# EAGLE design tester rp2040 (EAGLE 9.6.2)
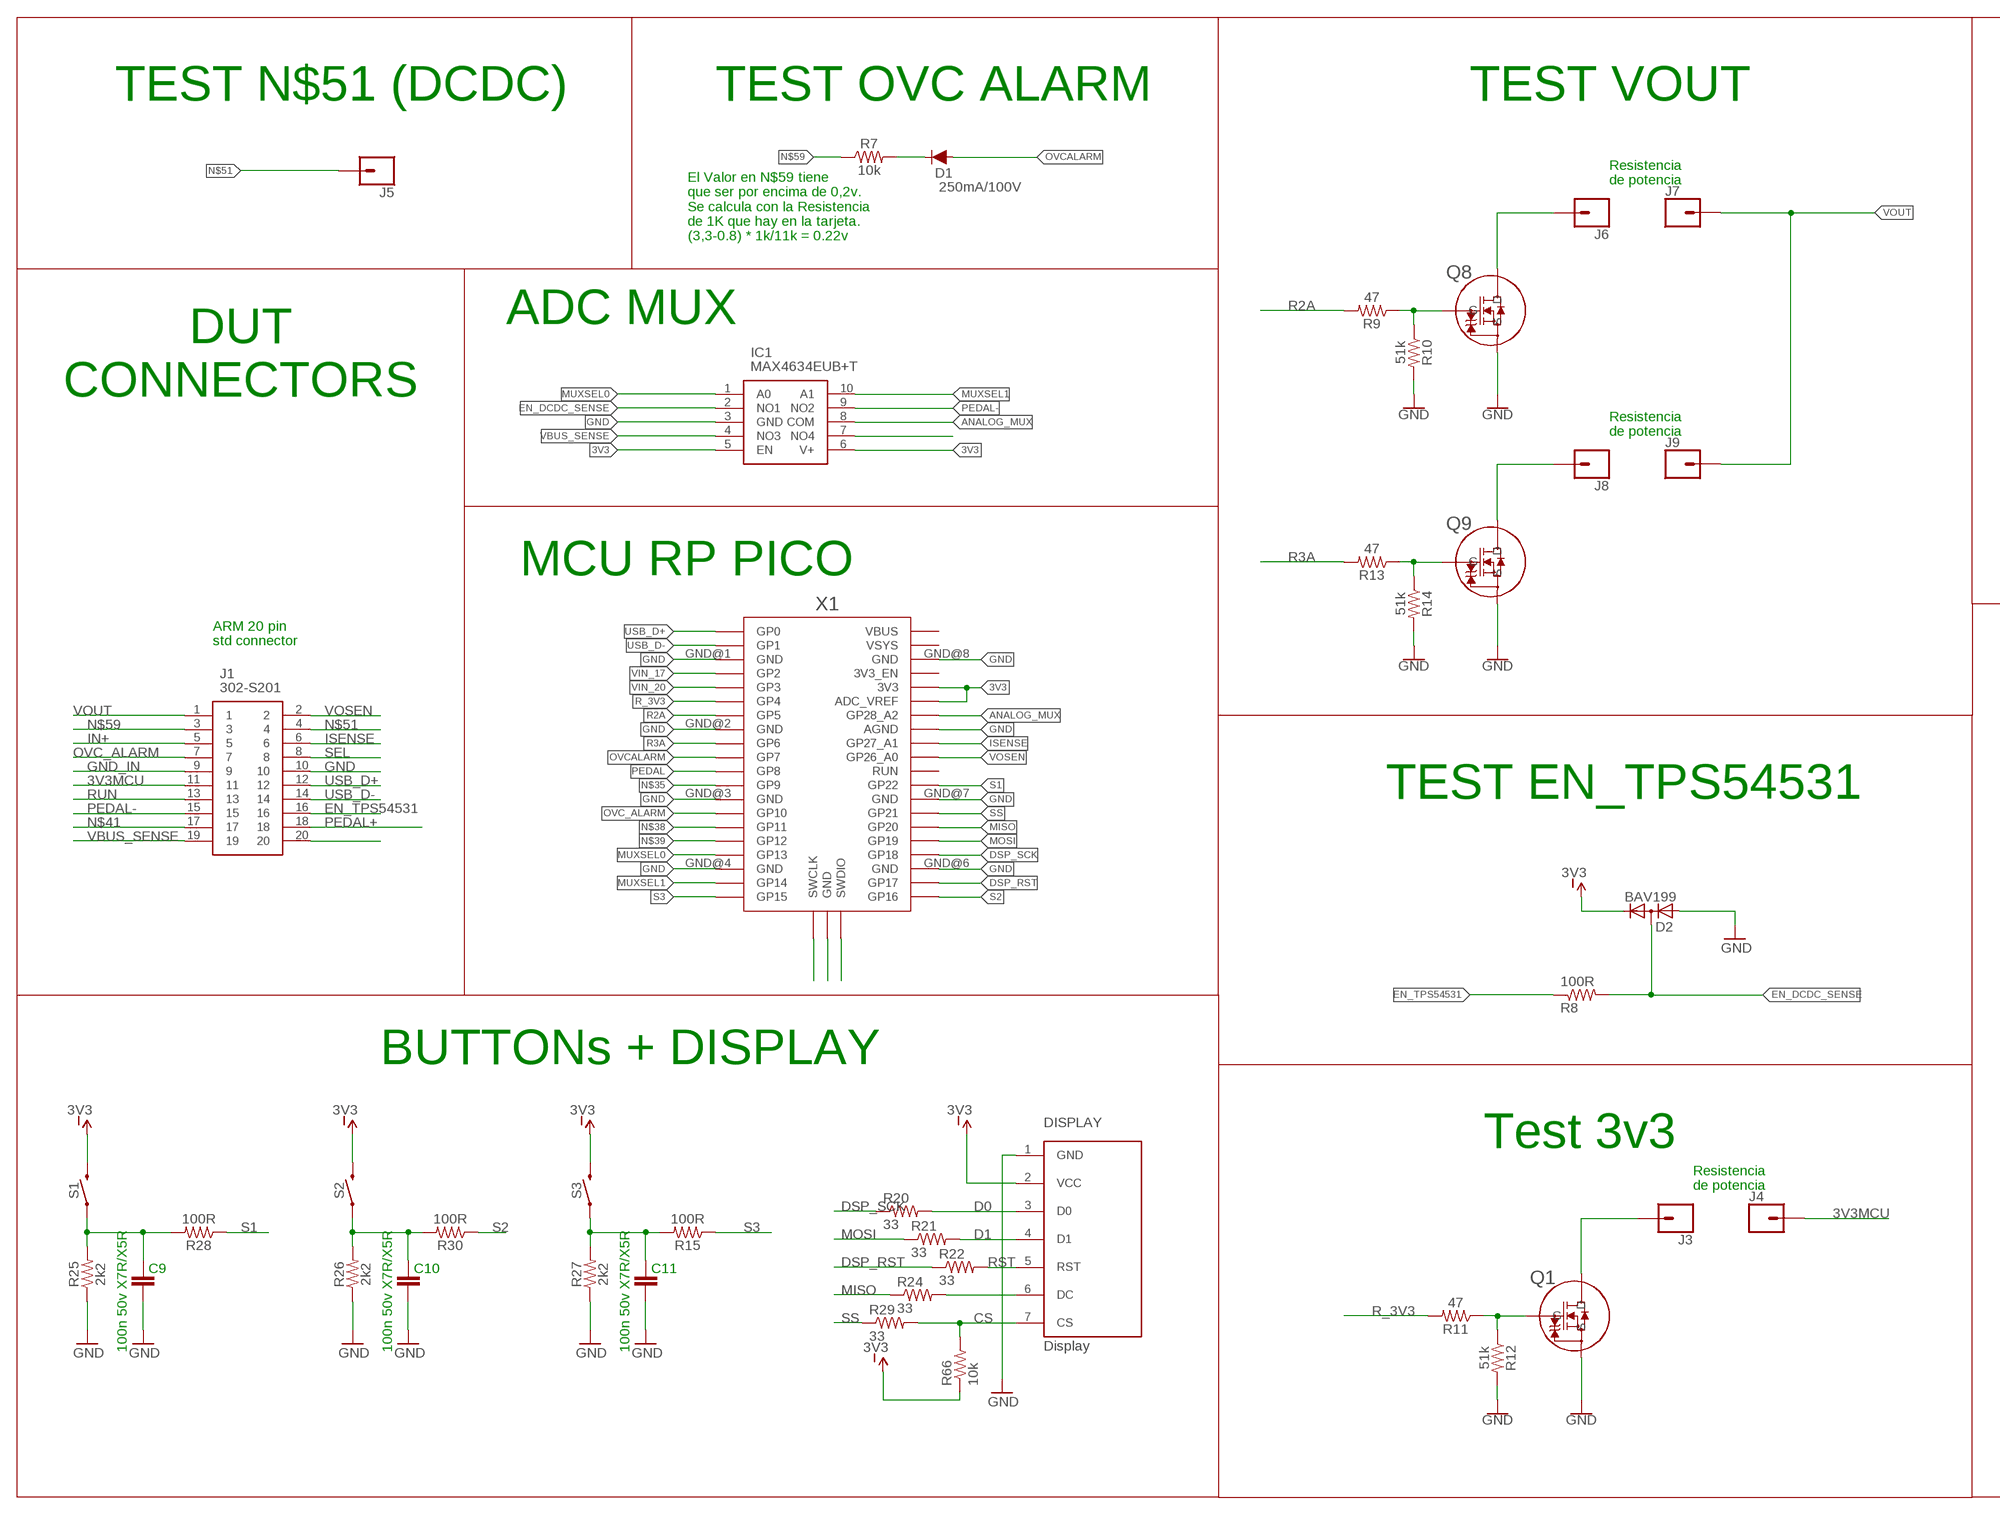
[diagram p0: schematic, sheet 1, part 1 of 2]
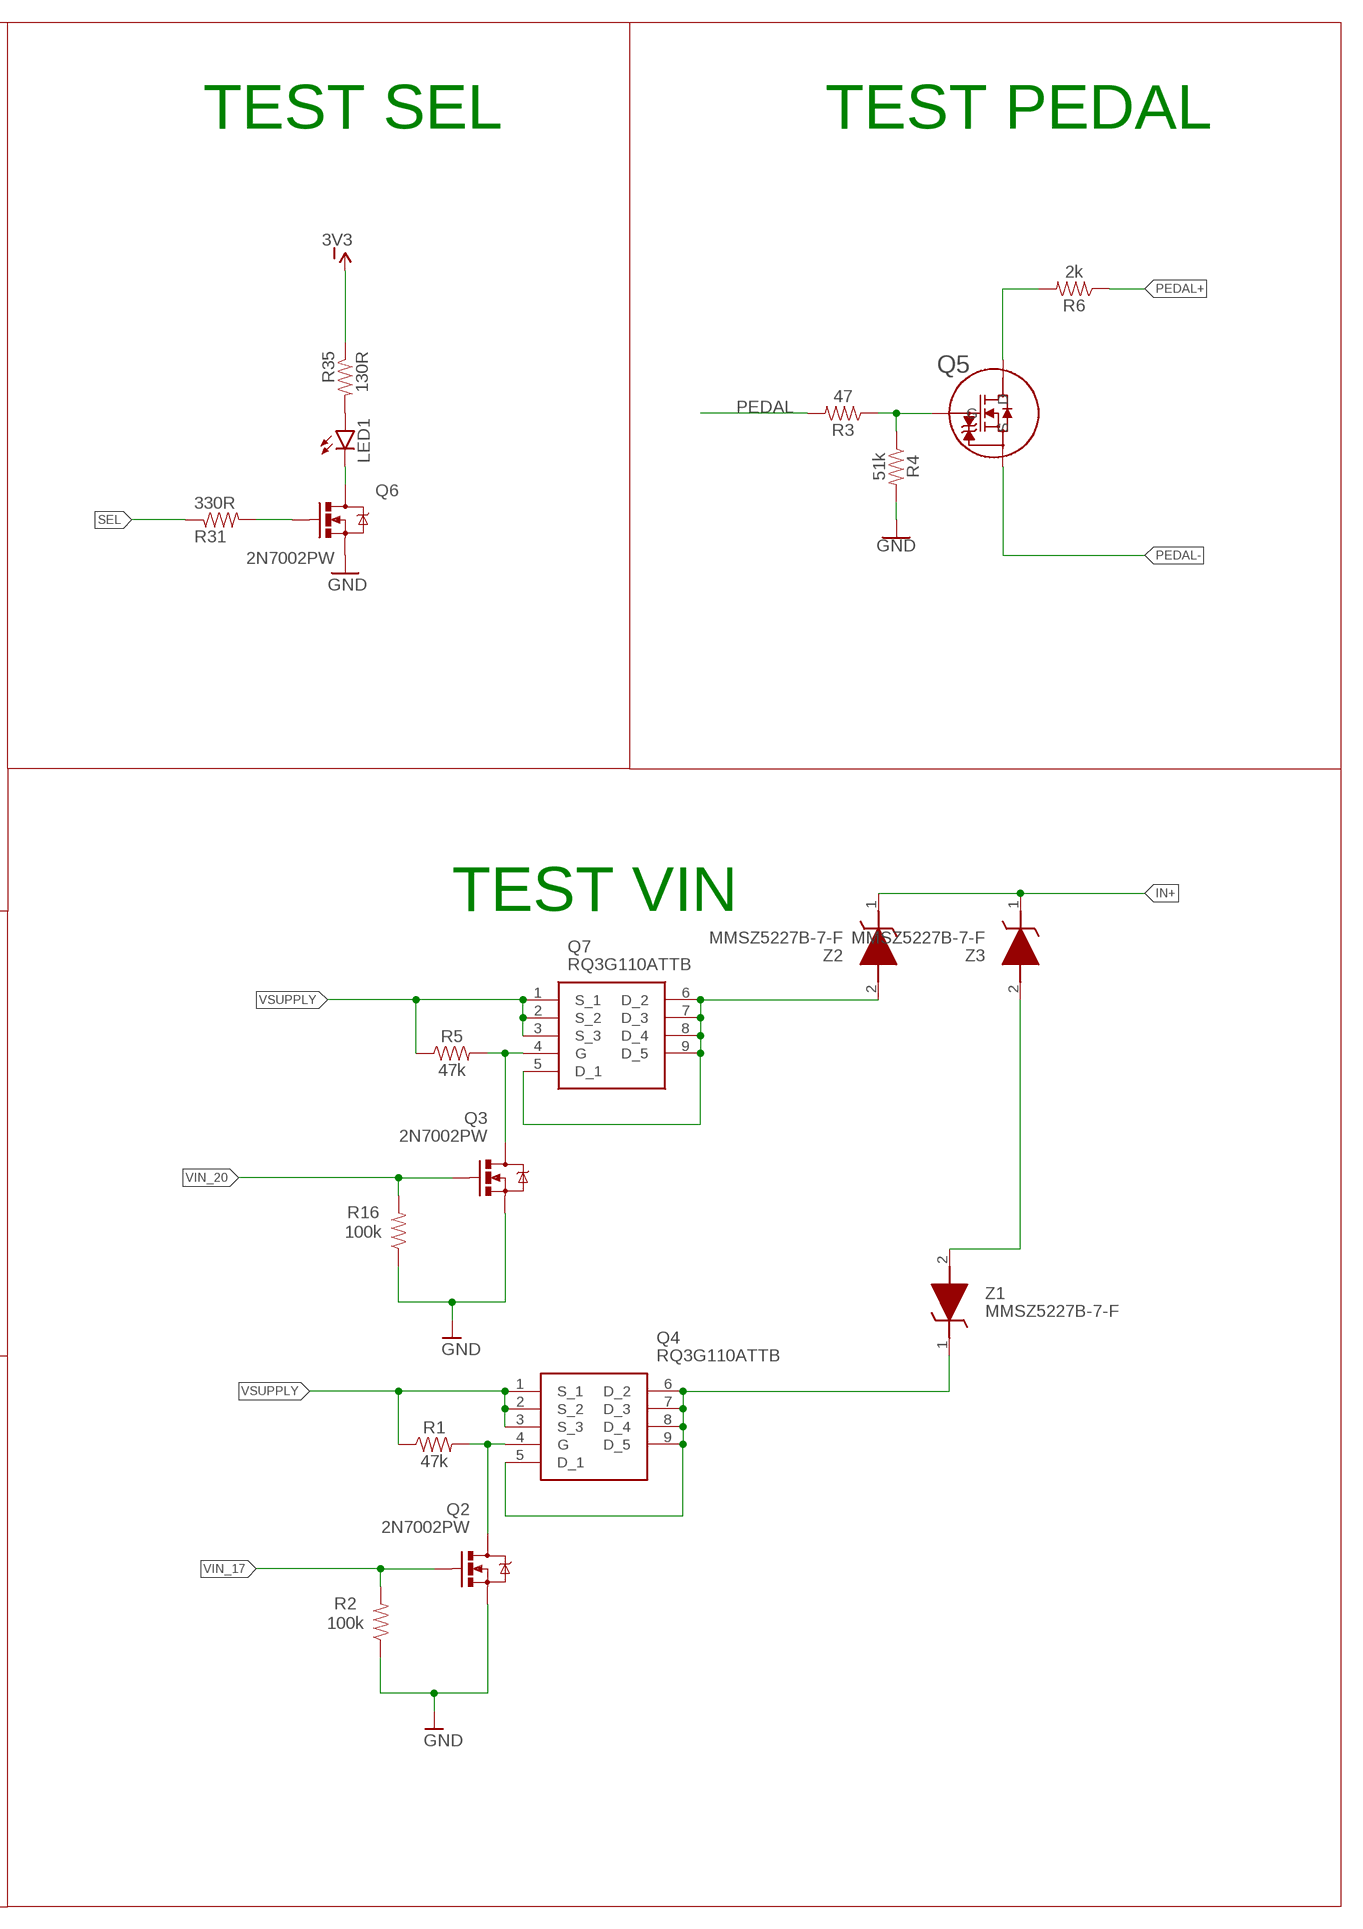
[diagram p1: schematic, sheet 1, part 2 of 2]

## Parts
C9  100n 50v X7R/X5R  CAP0805  [0805]
C10  100n 50v X7R/X5R  CAP0805  [0805]
C11  100n 50v X7R/X5R  CAP0805  [0805]
D1  250mA/100V  DIODE-BAS16J  [SOD-323]
D2  BAV199  [SOT23]
DISPLAY  Display  OLED_LCD  [OLED_LCD]
IC1  MAX4634EUB+T  [SOP50P490X110-10N]
J1  302-S201  [SHDR20W66P254_2X10_3300X905X90]
J3  CONN_01  [1X01]
J4  CONN_01  [1X01]
J5  CONN_01  [1X01]
J6  CONN_01  [1X01]
J7  CONN_01  [1X01]
J8  CONN_01  [1X01]
J9  CONN_01  [1X01]
LED1  LED3MM  [LED3MM]
Q1  PJA3416AE_R1_00001  [SOT23_PJA3416_PNJ]
Q2  2N7002PW  MOSFET-NCHANNEL2N7002PW  [SOT323]
Q3  2N7002PW  MOSFET-NCHANNEL2N7002PW  [SOT323]
Q4  RQ3G110ATTB  [RQ3G110ATTB]
Q5  PJA3416AE_R1_00001  [SOT23_PJA3416_PNJ]
Q6  2N7002PW  MOSFET-NCHANNEL2N7002PW  [SOT323]
Q7  RQ3G110ATTB  [RQ3G110ATTB]
Q8  PJA3416AE_R1_00001  [SOT23_PJA3416_PNJ]
Q9  PJA3416AE_R1_00001  [SOT23_PJA3416_PNJ]
R1  47k  RESISTOR0402  [0402]
R2  100k  RESISTOR0402  [0402]
R3  47  RESISTOR0805  [0805]
R4  51k  RESISTOR0805  [0805]
R5  47k  RESISTOR0402  [0402]
R6  2k  RESISTOR0805  [0805]
R7  10k  RESISTOR0805  [0805]
R8  100R  RESISTOR0805  [0805]
R9  47  RESISTOR0805  [0805]
R10  51k  RESISTOR0805  [0805]
R11  47  RESISTOR0805  [0805]
R12  51k  RESISTOR0805  [0805]
R13  47  RESISTOR0805  [0805]
R14  51k  RESISTOR0805  [0805]
R15  100R  RESISTOR0805  [0805]
R16  100k  RESISTOR0402  [0402]
R20  33  RESISTOR0805  [0805]
R21  33  RESISTOR0805  [0805]
R22  33  RESISTOR0805  [0805]
R24  33  RESISTOR0805  [0805]
R25  2k2  RESISTOR0805  [0805]
R26  2k2  RESISTOR0805  [0805]
R27  2k2  RESISTOR0805  [0805]
R28  100R  RESISTOR0805  [0805]
R29  33  RESISTOR0805  [0805]
R30  100R  RESISTOR0805  [0805]
R31  330R  RESISTOR0805  [0805]
R35  130R  RESISTOR0805  [0805]
R66  10k  RESISTOR0805  [0805]
S1  MOMENTARY-SWITCH-SPST-SMD-5.2MM  [TACTILE_SWITCH_SMD_5.2MM]
S2  MOMENTARY-SWITCH-SPST-SMD-5.2MM  [TACTILE_SWITCH_SMD_5.2MM]
S3  MOMENTARY-SWITCH-SPST-SMD-5.2MM  [TACTILE_SWITCH_SMD_5.2MM]
X1  RPI_PICO_IG-TH  [RPI_PICO_TH]
Z1  MMSZ5227B-7-F  [SOD3716X135N]
Z2  MMSZ5227B-7-F  [SOD3716X135N]
Z3  MMSZ5227B-7-F  [SOD3716X135N]

## Nets
3V3: D2.2(C) DISPLAY.2(VCC) IC1.5(EN) IC1.6(V+) R35.1 R66.1 S1.3 S2.3 S3.3 X1.3V3 X1.ADC_VREF
3V3MCU: J1.11 J4.1
ANALOG_MUX: IC1.8(COM) X1.GP28_A2
CS: DISPLAY.7(CS) R29.2 R66.2
D0: DISPLAY.3(D0) R20.2
D1: DISPLAY.4(D1) R21.2
DSP_RST: R22.1 X1.GP17
DSP_SCK: R20.1 X1.GP18
EN_DCDC_SENSE: D2.3(AC) IC1.2(NO1) R8.2
EN_TPS54531: J1.16 R8.1
GND: C9.1 C10.1 C11.1 D2.1(A) DISPLAY.1(GND) IC1.3(GND) J1.10 Q1.2(S) Q2.2(S) Q3.2(S) Q6.2(S) Q8.2(S) Q9.2(S) R2.1 R4.2 R10.2 R12.2 R14.2 R16.1 R25.1 R26.1 R27.1 X1.AGND X1.GND@1(GND) X1.GND@2(GND) X1.GND@3(GND) X1.GND@4(GND) X1.GND@6(GND) X1.GND@7(GND) X1.GND@8(GND)
GND_IN: J1.9
IN+: J1.5 Q7.5(D_1) Q7.6(D_2) Q7.7(D_3) Q7.8(D_4) Q7.9(D_5) Z2.1(K) Z2.2(A) Z3.1(K)
ISENSE: J1.6 X1.GP27_A1
MISO: R24.1 X1.GP20
MOSI: R21.1 X1.GP19
MUXSEL0: IC1.1(A0) X1.GP13
MUXSEL1: IC1.10(A1) X1.GP14
N$1: J3.1 Q1.3(D)
N$2: Z1.2(A) Z3.2(A)
N$3: Q3.3(D) Q7.4(G) R5.2
N$4: D1.C R7.2
N$5: Q2.3(D) Q4.4(G) R1.2
N$7: DISPLAY.6(DC) R24.2
N$9: Q5.1(G) R3.1 R4.1
N$14: Q4.5(D_1) Q4.6(D_2) Q4.7(D_3) Q4.8(D_4) Q4.9(D_5) Z1.1(K)
N$19: Q1.1(G) R11.1 R12.1
N$20: J1.20
N$21: Q5.3(D) R6.2
N$24: Q6.1(G) R31.2
N$25: LED1.A R35.2
N$26: LED1.K(C) Q6.3(D)
N$31: Q8.1(G) R9.1 R10.1
N$35: X1.GP9
N$36: J6.1 Q8.3(D)
N$38: X1.GP11
N$39: X1.GP12
N$41: J1.17
N$42: Q9.1(G) R13.1 R14.1
N$45: X1.SWCLK
N$46: X1.GND@5(GND)
N$47: X1.SWDIO
N$48: J8.1 Q9.3(D)
N$49: C9.2 R25.2 R28.2 S1.1
N$50: C10.2 R26.2 R30.2 S2.1
N$51: J1.4 J5.1
N$52: C11.2 R15.2 R27.2 S3.1
N$58: IC1.7(NO4)
N$59: J1.3 R7.1
OVC_ALARM: J1.7 X1.GP10
OVCALARM: D1.A X1.GP7
PEDAL: R3.2 X1.GP8
PEDAL+: J1.18 R6.1
PEDAL-: IC1.9(NO2) J1.15 Q5.2(S)
R2A: R9.2 X1.GP5
R3A: R13.2 X1.GP6
R_3V3: R11.2 X1.GP4
RST: DISPLAY.5(RST) R22.2
RUN: J1.13
S1: R28.1 X1.GP22
S2: R30.1 X1.GP16
S3: R15.1 X1.GP15
SEL: J1.8 R31.1
SS: R29.1 X1.GP21
USB_D+: J1.12 X1.GP0
USB_D-: J1.14 X1.GP1
VBUS_SENSE: IC1.4(NO3) J1.19
VIN_17: Q2.1(G) R2.2 X1.GP2
VIN_20: Q3.1(G) R16.2 X1.GP3
VOSEN: J1.2 X1.GP26_A0
VOUT: J1.1 J7.1 J9.1
VSUPPLY: Q4.1(S_1) Q4.2(S_2) Q4.3(S_3) Q7.1(S_1) Q7.2(S_2) Q7.3(S_3) R1.1 R5.1
Unconnected: X1.3V3_EN X1.RUN X1.VBUS X1.VSYS

## Notes on the sheet
- TEST N$51 (DCDC) | TEST OVC ALARM | TEST VOUT | TEST SEL | TEST PEDAL
- Resistencia
  de potencia
- El Valor en N$59 tiene
  que ser por encima de 0,2v.
  Se calcula con la Resistencia 
  de 1K que hay en la tarjeta.
  (3,3-0.8) * 1k/11k = 0.22v
- ADC MUX
- DUT
  CONNECTORS
- Resistencia
  de potencia
- MCU RP PICO
- ARM 20 pin
  std connector
- TEST VIN
- TEST EN_TPS54531
- BUTTONs + DISPLAY
- Test 3v3
- Resistencia
  de potencia

## Library data of the parts
C9-C11 = SparkFun-Passives:CAP: Capacitor Standard 0603 ceramic capacitor, and 0.1" leaded capacitor.
D1 = SparkFun-DiscreteSemi:DIODE: Diode These are standard reverse protection diodes and small signal diodes. SparkFun Products: SparkFun SparkPunk Sound Kit <https://www.sparkfun.com/products/11177> SparkFun ESP8266 Thing <https://www.sparkfun.com/products/13231>; PROD_ID: DIO-09646
D2 = diode:BAV199: DIODE low-leakage double diode
DISPLAY = EDCPSU:OLED_LCD
IC1 = MAX4634EUB+T:MAX4634EUB+T: Multiplexer Switch ICs Fast, Low-Voltage, 4 Ohm, 4-Channel CMOS Analog Multiplexer Source: Datasheet <https://datasheets.maximintegrated.com/en/ds/MAX4634.pdf>; ARROW_PART_NUMBER: MAX4634EUB+T; ARROW_PRICE-STOCK: https://www.arrow.com/en/products/max4634eubt/maxim-integrated?region=nac; DESCRIPTION: Multiplexer Switch ICs Fast, Low-Voltage, 4 Ohm, 4-Channel CMOS Analog Multiplexer; HEIGHT: 1.1mm; MANUFACTURER_NAME: Analog Devices; MANUFACTURER_PART_NUMBER: MAX4634EUB+T; MOUSER_PART_NUMBER: 700-MAX4634EUBT; MOUSER_PRICE-STOCK: https://www.mouser.co.uk/ProductDetail/Maxim-Integrated/MAX4634EUB%2bT?qs=LHmEVA8xxfaJv5r8NBN1ug%3D%3D
J1 = 302-S201:302-S201: CONN HEADER VERT 20POS GOLD Source: Datasheet <http://www.on-shore.com/wp-content/uploads/2018/04/302-SXX1.pdf>; DESCRIPTION: CONN HEADER VERT 20POS GOLD; HEIGHT: 9.05mm; MANUFACTURER_NAME: On Shore Technology Inc.; MANUFACTURER_PART_NUMBER: 302-S201
J3-J9 = SparkFun-Connectors:CONN_01: Single connection point. Often used as Generic Header-pin footprint for 0.1 inch spaced/style header connections On any of the 0.1 inch spaced packages, you can populate with these: Break Away Headers - Straight <https://www.sparkfun.com/products/116> (PRT-00116) Break Away Male Headers - Right Angle <https://www.sparkfun.com/products/553> (PRT-00553) Female Headers <https://www.sparkfun.com/products/115> (PRT-00115) Break Away Headers - Machine Pin <https://www.sparkfun.com/products/117> (PRT-00117) Break Away Female Headers - Swiss Machine Pin <https://www.sparkfun.com/products/743> (PRT-00743) This device is also useful as a general connection point to wire up your design to another part of your project. Our various solder wires solder well into these plated through hole pads. Hook-Up Wire - Assortment (Stranded, 22 AWG) <https://www.sparkfun.com/products/11375> (PRT-11375) Hook-Up Wire - Assortment (Solid Core, 22 AWG) <https://www.sparkfun.com/products/11367> (PRT-11367) View the entire wire category on our website here <https://www.sparkfun.com/categories/141> Special notes: SMTSO-256-ET is a "flush mount" nut for a 4-40 screw. We mostly use this on specialty testbeds; it is a nice way to connect hardware to your PCB at an adjustable hieght. Also note, the SNAP packages are for using a snappable style connector. We sell a baggie of snaps and they are also used on two LilyPad designs: Snap Assortment - 30 pack (male and female) <https://www.sparkfun.com/products/11347> (DEV-11347) LilyPad Arduino SimpleSnap <https://www.sparkfun.com/products/10941> (DEV-10941) LilyPad SimpleSnap Protoboard <https://www.sparkfun.com/products/10940> (DEV-10940)
LED1 = SparkFun-LED:LED: LEDs Standard schematic elements and footprints for 5mm, 3mm, 1206, and 0603 sized LEDs. 5mm - Spark Fun Electronics SKU : COM-00529 (and others)
Q1 Q5 Q8 Q9 = PJA3416AE_R1_00001:PJA3416AE_R1_00001; COPYRIGHT: Copyright (C) 2022 Ultra Librarian. All rights reserved.; DIGI-KEY_PART_NUMBER_1: 3757-PJA3416AE_R1_00001TR-ND; DIGI-KEY_PART_NUMBER_2: 3757-PJA3416AE_R1_00001CT-ND; DIGI-KEY_PART_NUMBER_3: 3757-PJA3416AE_R1_00001DKR-ND; MANUFACTURER_PART_NUMBER: PJA3416AE_R1_00001; MFR_NAME: Panjit
Q2 Q3 Q6 = SparkFun-DiscreteSemi:MOSFET-NCHANNEL: Common NMOSFET Parts MFG P/N Store ID Prod ID FDD8780 TRANS-09984 SI7820DN TRANS-11055 FDS6630A IC-08089 2N7002PW TRANS-11151 FQP30N06L COM-10213 TRANS-10060 BSS123LT1G TRANS-08345 BSS138 TRANS-00830 BS170 2N7000; PROD_ID: TRANS-11151
Q4 Q7 = RQ3G110ATTB:RQ3G110ATTB: ROHM - RQ3G110ATTB - Power MOSFET, P Channel, 40 V, 35 A, 0.0098 ohm, RDS 12.4m, PD 20W, HSMT8, Surface Mount Source: Datasheet <https://fscdn.rohm.com/en/products/databook/datasheet/discrete/transistor/mosfet/rq3g110attb-e.pdf>; DESCRIPTION: ROHM - RQ3G110ATTB - Power MOSFET, P Channel, 40 V, 35 A, 0.0098 ohm, RDS 12.4m, PD 20W, HSMT8, Surface Mount; HEIGHT: 0.9mm; MANUFACTURER_NAME: ROHM Semiconductor; MANUFACTURER_PART_NUMBER: RQ3G110ATTB; MOUSER_PART_NUMBER: 755-RQ3G110ATTB; MOUSER_PRICE-STOCK: https://www.mouser.co.uk/ProductDetail/ROHM-Semiconductor/RQ3G110ATTB?qs=XAiT9M5g4x8pt4K24teB1Q%3D%3D
R1-R16 R20-R22 R24-R31 R35 R66 = SparkFun-Resistors:RESISTOR: Generic Resistor Package
S1-S3 = SparkFun-Switches:MOMENTARY-SWITCH-SPST: Momentary Switch (Pushbutton) - SPST Normally-open (NO) SPST momentary switches (buttons, pushbuttons). Variants PTH-12MM - 12mm square, through-hole Momentary Pushbutton Switch - 12mm Square <https://www.sparkfun.com/products/9190> (COM-09190) PTH-6.0MM, PTH-6.0MM-KIT - 6.0mm square, through-hole Mini Pushbutton Switch <https://www.sparkfun.com/products/97> (COM-00097) KIT package intended for soldering kit's - only one side of pads' copper is exposed. PTH-RIGHT-ANGLE-KIT - Right-angle, through-hole Right Angle Tactile Button <https://www.sparkfun.com/products/10791> - Used on SparkFun BigTime Watch Kit <https://www.sparkfun.com/products/11734> SMD-12MM - 12mm square, surface-mount Tactile Button - SMD (12mm) <https://www.sparkfun.com/products/12993> (COM-12993) Used on SparkFun PicoBoard <https://www.sparkfun.com/products/11888> SMD-4.5MM - 4.5mm Square Trackball Switch Used on SparkFun Blackberry Trackballer Breakout <https://www.sparkfun.com/products/13169> SMD-4.6MMX2.8MM - 4.60mm x 2.80mm, surface mount Used on SparkFun SAMD21 Mini Breakout <https://www.sparkfun.com/products/13664> SMD-5.2MM, SMD-5.2-REDUNDANT - 5.2mm square, surface-mount Mini Pushbutton Switch - SMD <https://www.sparkfun.com/products/8720> (COM-08720) Used on Arduino Pro Mini <https://www.sparkfun.com/products/11114> REDUNDANT package connects both switch circuits together SMD-6.0X3.5MM - 6.0 x 3.5mm, surface mount Momentary Reset Switch SMD <https://www.sparkfun.com/products/8229> (COM-08229) SMD-6.2MM-TALL - 6.2mm square, surface mount Tactile Button - SMD (6mm) <https://www.sparkfun.com/products/12992> Used on SparkFun Digital Sandbox <https://www.sparkfun.com/products/12651> SMD-RIGHT-ANGLE - Right-angle, surface mount Used on SparkFun Block for Intel® Edison - Arduino <https://www.sparkfun.com/products/13036>; PROD_ID: SWCH-08247; SF_SKU: COM-08720
X1 = RaspberryPi_Pico:RPI_PICO_IG
Z1-Z3 = MMSZ5227B-7-F:MMSZ5227B-7-F: Diode Zener 3.6V 5% 500mW 2Pin SOD123 Diodes Inc MMSZ5227B-7-F Zener Diode, 3.6V 5% 500 mW SMT 2-Pin SOD-123 Source: Datasheet <https://www.diodes.com/assets/Datasheets/ds18010.pdf>; ARROW_PART_NUMBER: MMSZ5227B-7-F; ARROW_PRICE-STOCK: https://www.arrow.com/en/products/mmsz5227b-7-f/diodes-incorporated; DESCRIPTION: Diode Zener 3.6V 5% 500mW 2Pin SOD123 Diodes Inc MMSZ5227B-7-F Zener Diode, 3.6V 5% 500 mW SMT 2-Pin SOD-123; HEIGHT: 1.35mm; MANUFACTURER_NAME: Diodes Inc.; MANUFACTURER_PART_NUMBER: MMSZ5227B-7-F; MOUSER_PART_NUMBER: 621-MMSZ5227B-F; MOUSER_PRICE-STOCK: https://www.mouser.com/Search/Refine.aspx?Keyword=621-MMSZ5227B-F

## Board
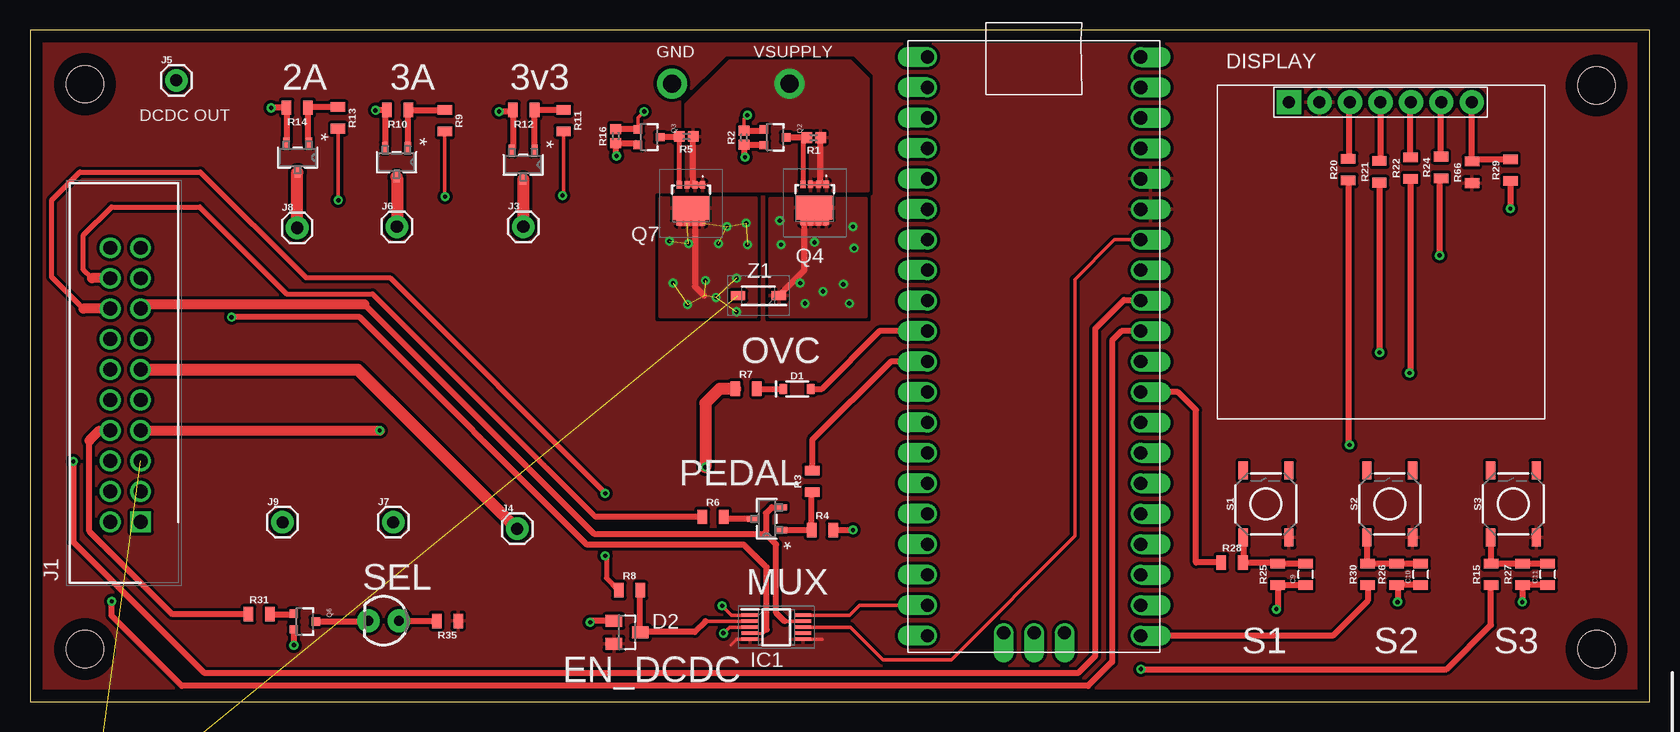
[diagram p2: board, top side]
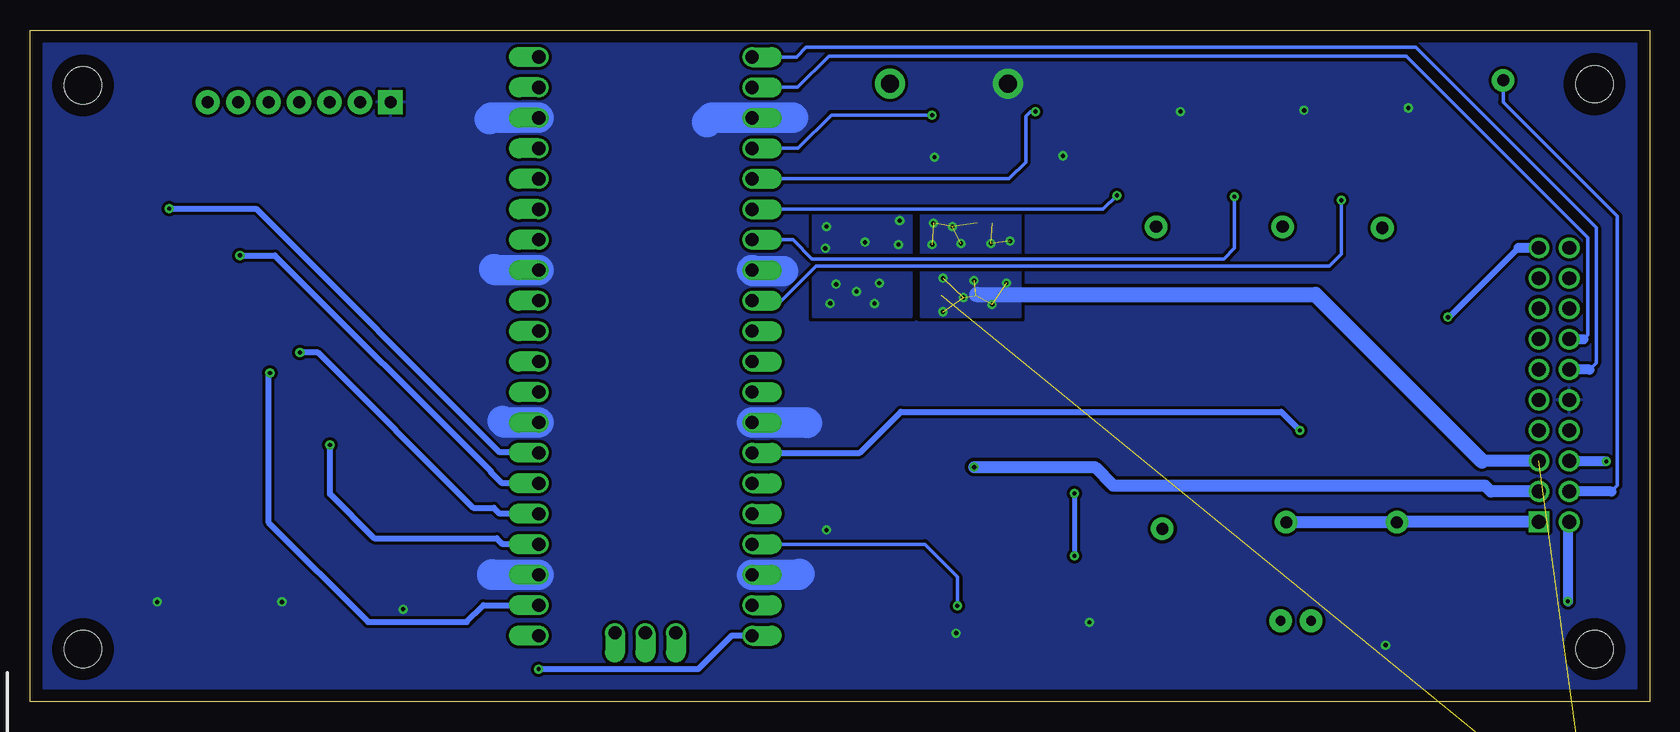
[diagram p3: board, bottom side, seen from below]

Size 135 x 56 mm. Coordinates in mm from the lower left corner, seen from the top.
Outline: 0,0 135,0 135,56 0,56 0,0
Copper layers (1*16): Top 0.035mm / dielectric 1.5mm / Bottom 0.035mm
Design rules "default *": minimum track width 6mil, minimum drill 0.35mm, track to track 8mil, track to pad 8mil, pad to pad 8mil, via to via 8mil, smd to smd 8mil, copper to edge 40mil, drill to drill 6mil, minimum pad ring 10mil, minimum via ring 8mil, stop-mask expansion 4mil, vias tented up to drill 0mil, thermal gap 10mil
Holes 3.1 mm at 4.58,51.48 4.58,4.38 130.58,4.38 130.58,51.38

### Footprints (pad centres in the part's own frame; a part is rotated, then mirrored left to right if it is on the bottom)
0805 = smd 0.8 x 1.2: 1 -0.9,0; 2 0.9,0
SOD-323 = smd 0.63 x 0.83: A 1.15,0; C -1.15,0
SOT23 = smd 1 x 1.4: 1 -0.95,-1.1; 2 0.95,-1.1; 3 0,1.1
OLED_LCD = drill 1.016 pad 2.032 square: 1 -7.42,13.7 | drill 1.016 pad 2.032: 2 -4.88,13.7; 3 -2.34,13.7; 4 0.2,13.7; 5 2.74,13.7; 6 5.28,13.7; 7 7.82,13.7
SOP50P490X110-10N = smd 1.4 x 0.3: 1 -2.2,1; 2 -2.2,0.5; 3 -2.2,0; 4 -2.2,-0.5; 5 -2.2,-1; 6 2.2,-1; 7 2.2,-0.5; 8 2.2,0; 9 2.2,0.5; 10 2.2,1
SHDR20W66P254_2X10_3300X905X90 = drill 1.15 pad 1.725 square: 1 0,0 | drill 1.15 pad 1.725: 2 0,2.54; 3 2.54,0; 4 2.54,2.54; 5 5.08,0; 6 5.08,2.54; 7 7.62,0; 8 7.62,2.54; 9 10.16,0; 10 10.16,2.54; 11 12.7,0; 12 12.7,2.54; 13 15.24,0; 14 15.24,2.54; 15 17.78,0; 16 17.78,2.54; 17 20.32,0; 18 20.32,2.54; 19 22.86,0; 20 22.86,2.54
1X01 = drill 1.016 pad 1.88: 1 0,0
LED3MM = drill 0.813 pad 1.88: A -1.27,0; K 1.27,0
SOT23_PJA3416_PNJ = smd 0.864 x 0.508: 1 -1.232,0.95; 2 -1.232,-0.95; 3 1.232,0
SOT323 = smd 0.7 x 0.7: 1 -0.65,-0.925; 2 0.65,-0.925; 3 0,0.925
RQ3G110ATTB = smd 0.43 x 0.6: 1 -0.975,-1.55; 2 -0.325,-1.55; 3 0.325,-1.55; 4 0.975,-1.55 | smd 0.43 x 0.45: 5 0.975,1.625; 6 0.325,1.625; 7 -0.325,1.625; 8 -0.975,1.625 | smd 3 x 2: 9 0,0.4
0402 = smd 0.85 x 0.9: 1 -0.58,0; 2 0.58,0
TACTILE_SWITCH_SMD_5.2MM = smd 1.524 x 0.762: 1 -2.794,1.905; 2 2.794,1.905; 3 -2.794,-1.905; 4 2.794,-1.905
RPI_PICO_TH = drill 1.1 pad 1.6 offset: 3V3 8.89,13.97; 3V3_EN 8.89,16.51; ADC_VREF 8.89,11.43; AGND 8.89,6.35; GND@1 -8.89,19.05; GND@2 -8.89,6.35; GND@3 -8.89,-6.35; GND@4 -8.89,-19.05; GND@5 0,-23.9; GND@6 8.89,-19.05; GND@7 8.89,-6.35; GND@8 8.89,19.05; GP0 -8.89,24.13; GP1 -8.89,21.59; GP2 -8.89,16.51; GP3 -8.89,13.97; GP4 -8.89,11.43; GP5 -8.89,8.89; GP6 -8.89,3.81; GP7 -8.89,1.27; GP8 -8.89,-1.27; GP9 -8.89,-3.81; GP10 -8.89,-8.89; GP11 -8.89,-11.43; GP12 -8.89,-13.97; GP13 -8.89,-16.51; GP14 -8.89,-21.59; GP15 -8.89,-24.13; GP16 8.89,-24.13; GP17 8.89,-21.59; GP18 8.89,-16.51; GP19 8.89,-13.97; GP20 8.89,-11.43; GP21 8.89,-8.89; GP22 8.89,-3.81; GP26_A0 8.89,1.27; GP27_A1 8.89,3.81; GP28_A2 8.89,8.89; RUN 8.89,-1.27; SWCLK -2.54,-23.9; SWDIO 2.54,-23.9; VBUS 8.89,24.13; VSYS 8.89,21.59
SOD3716X135N = smd 1.2 x 0.75: 1 -1.7,0; 2 1.7,0

### Placement (x,y rotation side)
C9  106.33,10.61 90 top
C10  115.93,10.61 90 top
C11  126.51,10.61 90 top
D1  63.95,26.08 0 top
D2  49.77,5.77 270 top
DISPLAY  112.37,36.28 0 top
IC1  62.22,6.2 0 top
J1  9.22,14.98 90 top
J3  41.12,39.6 0 top
J4  40.61,14.4 0 top
J5  12.2,51.8 0 top
J6  30.59,39.6 0 top
J7  30.28,14.95 0 top
J8  22.27,39.5 0 top
J9  21.06,14.95 0 top
LED1  29.47,6.73 180 top
Q1  41.11,44.76 270 top
Q2  62.1,47.05 270 top
Q3  51.6,47.06 270 top
Q4  65.4,41.58 180 top
Q5  61.42,15.24 180 top
Q6  22.9,6.67 270 top
Q7  55.1,41.54 180 top
Q8  30.55,44.98 270 top
Q9  22.31,45.37 270 top
R1  65.33,47.02 180 top
R2  59.52,47.03 90 top
R3  65.2,18.36 90 top
R4  66.05,14.3 0 top
R5  54.71,47.12 180 top
R6  56.94,15.4 0 top
R7  59.69,26.08 0 top
R8  49.98,9.28 0 top
R9  34.58,48.43 270 top
R10  30.64,49.32 180 top
R11  44.48,48.45 270 top
R12  41.16,49.32 180 top
R13  25.68,48.67 270 top
R14  22.28,49.52 180 top
R15  121.78,10.61 90 top
R16  48.82,47.15 90 top
R20  109.88,44.36 90 top
R21  112.48,44.17 90 top
R22  115.08,44.48 90 top
R24  117.62,44.54 90 top
R25  104,10.61 90 top
R26  113.9,10.61 90 top
R27  124.4,10.61 90 top
R28  100.2,11.6 0 top
R29  123.4,44.31 90 top
R30  111.5,10.61 90 top
R31  19.11,7.28 0 top
R35  34.8,6.72 180 top
R66  120.2,44.13 90 top
S1  103.03,16.48 90 top
S2  113.34,16.48 90 top
S3  123.65,16.48 90 top
X1  83.7,29.62 0 top
Z1  60.72,33.85 180 top
Z2  3.9,-6.4 0 top  (outside the outline)
Z3  3.9,-9.8 0 top  (outside the outline)

### Tracks (layer width: path | path; a pad name or v marks a point on that pad's centre or on a via)
3V3
  Top 0.254: 58.9,5.2 58.4,4.7
  Top 0.305: IC1.5 58.9,5.2 | IC1.6 66,5.2
  pour Top (isolate 0.254, rank 2): -3.2,-4.4 136.7,-4.4 136.7,58 -3.2,58
3V3MCU
  Top 1.016: J1.11 27.33,27.68 J4.1
ANALOG_MUX
  Top 0.305: IC1.8 68.4,6.2 71.1,3.5 76.8,3.5 87.1,13.8 87.1,35.2 90.41,38.51 X1.GP28_A2
CS
  Top 0.508: DISPLAY.7 R66.2 120.38,45.21 R29.2
D0
  Top 0.508: R20.2 109.93,45.31 109.93,49.88 DISPLAY.3
D1
  Top 0.508: DISPLAY.4 112.57,45.16 R21.2
DSP_RST  (via drill 0.35)
  Top 0.508: R22.1 115.08,27.48 v115,27.4
  Bottom 0.508: X1.GP17 97.19,8.03 98.59,6.63 106.83,6.63 115.1,14.9 115.1,27.3 v115,27.4
DSP_SCK  (via drill 0.35)
  Top 0.508: R20.1 109.88,21.52 v110,21.4
  Bottom 0.508: X1.GP18 95.59,13.11 96.09,13.61 106.31,13.61 110,17.3 v110,21.4
EN_DCDC_SENSE
  Top 0.305: IC1.2 56.3,6.7
  Top 0.508: D2.3 50.87,5.8 | 50.87,5.8 R8.2 | 50.87,5.8 55.4,5.8 56.3,6.7
EN_TPS54531  (via drill 0.35)
  Top 0.406: 4.44,32.76 1.8,35.4 1.8,41.8 4.15,44.15 14.2,44.15 23,35.35 30,35.35 47.95,17.4 v47.95,17.35 | R8.1 48.05,10.31 48.05,12.05 v47.95,12.15
  Top 0.813: J1.16 4.44,32.76
  Bottom 0.406: v47.95,17.35 v47.95,12.15
GND  (via drill 0.35, 1.5 pad 2.5)
  Top 0.305: IC1.3 58.3,6.2 v57.8,5.7
  Top 0.508: Q9.2 21.38,46.62 R14.2 20.12,49.52 v20.1,49.5 | Q8.2 29.6,49.18 R10.2 29.72,49.3 v28.8,49.3 | Q1.2 40.26,46.09 R12.2 40.14,49.2 v39.1,49.2 | Q3.2 50.52,46.57 R16.1 48.82,45.58 v48.9,45.5 | Q2.2 59.57,46.4 R2.1 59.52,45.48 v59.6,45.4 | Q6.2 21.98,4.72 v22,4.7 | D2.1 46.82,6.72 v46.7,6.6 | R4.2 v68.6,14.3 | C11.1 R27.1 v124.4,8.3 | C10.1 R26.1 114,9.61 v114,8.3 | C9.1 R25.1 104,7.6 v103.9,7.7
  Bottom 2.54: 78.55,48.3 78.18,48.67 X1.GND@1 71.43,48.67 71.4,48.7 | X1.GND@8 96.58,48.67 96.7,48.55 | X1.AGND 96.22,35.97 96.3,36.05 | X1.GND@7 95.47,23.27 95.6,23.4 | X1.GND@6 96.47,10.57 96.5,10.6 | X1.GND@4 70.93,10.57 70.85,10.65 | X1.GND@3 70.27,23.27 70.25,23.25 | X1.GND@2 74.74,35.9 72.25,35.9
  other vias: 53.5,51.54
  pour Bottom (isolate 0.254, rank 2): -3.4,-4.3 136.85,-4.3 136.85,58.4 -3.4,58.4
IN+  (via drill 0.35)  (16 unrouted)
  Top 0.508: Q7.5 55,39.91 | 55,39.91 Q7.7 | Q7.7 Q7.8 | Q7.7 55.42,34.62 56.2,33.85 | Q7.9 55.1,40.02 55,39.91 | Q7.6 Q7.7
  Bottom 1.016: J1.5 13.96,20.06 | 56.1,33.95 56.2,33.85
  Bottom 1.27: 56.1,33.95 27.85,33.95 13.96,20.06
  other vias: 53.3,38.4 54.9,38.2 57.4,38.2 59.8,38.1 59.7,39.9 58.1,39.6 58.9,35.3 58.9,32.5 54.8,33.1 53.6,34.9 56.3,35.1 57.2,33.7
  pour Bottom (isolate 0.254): 52.5,40.7 60.7,40.7 60.7,32.1 52.5,32.1
  pour Top (isolate 0.254): 52.5,42 60.5,42 60.5,32.1 52.5,32.1
ISENSE  (via drill 0.35)
  Top 0.508: X1.GP27_A1 92.59,33.5 91.2,33.5 88.8,31.1 88.8,3.8 87.4,2.4 14.5,2.4 3.6,13.3 v3.6,20.02
  Bottom 0.508: v3.6,20.02 3.64,20.06
  Bottom 0.813: J1.6 3.64,20.06
MISO  (via drill 0.35)
  Top 0.508: v117.5,37.2 117.5,43.52 R24.1
  Bottom 0.508: X1.GP20 95.64,18.19 96.59,19.14 96.54,19.14 114.6,37.2 v117.5,37.2
MOSI  (via drill 0.35)
  Top 0.508: R21.1 112.48,29.12 v112.5,29.1
  Bottom 0.508: X1.GP19 95.84,15.65 96.34,16.15 98.05,16.15 111,29.1 v112.5,29.1
MUXSEL0  (via drill 0.35)
  Top 0.305: v57.7,7.98 58.48,7.2 IC1.1
  Bottom 0.305: X1.GP13 60.41,13.11 57.7,10.4 v57.7,7.98
MUXSEL1
  Top 0.305: IC1.10 68.3,7.2 69.13,8.03 X1.GP14
N$1
  Top 1.016: Q1.3 41.12,43.52 J3.1
N$2  (1 unrouted)
N$3
  Top 0.406: 54.13,47.09 54.12,47.09 Q7.4
  Top 0.508: Q3.3 52.58,47.12 R5.2 54.13,47.09
N$4
  Top 0.508: R7.2 D1.C
N$5
  Top 0.406: R1.2 64.45,46.72 64.45,43.16 Q4.4
  Top 0.508: Q2.3 64.72,47.05 R1.2
N$7
  Top 0.508: R24.2 117.62,49.95 DISPLAY.6
N$9
  Top 0.508: Q5.1 62.66,14.3 R4.1 65.15,17.41 R3.1
N$14  (via drill 0.35)
  Top 0.508: Q4.5 65.1,39.95 | 65.1,39.95 Q4.7 Q4.8 | Z1.1 64.53,35.95 64.53,39.85 Q4.5 | Q4.6 Q4.5 | Q4.9 65.4,40.26 65.1,39.95
  other vias: 64.2,34.9 66.1,34.2 67.8,34.8 68.3,33.2 64.6,33.2 62.6,38.1 65.4,38.3 68.7,37.8 68.6,39.6 62.5,40.1
  pour Top (isolate 0.254): 61.7,41.95 69.7,41.95 69.7,32.1 61.7,32.1
  pour Bottom (isolate 0.254): 61.55,40.7 69.7,40.7 69.7,32.1 61.55,32.1
N$19
  Top 0.508: Q1.1 R12.1 42.09,49.35 R11.1
N$21
  Top 0.508: Q5.3 58,15.24 R6.2
N$24
  Top 0.152: 21.94,7.28 Q6.1
  Top 0.508: R31.2 21.94,7.28
N$25
  Top 0.508: LED1.A R35.2
N$26
  Top 0.508: Q6.3 28.14,6.67 LED1.K
N$31
  Top 0.508: Q8.1 31.5,49.28 R10.1 R9.1
N$36
  Top 1.016: Q8.3 30.59,43.71 J6.1
N$42
  Top 0.508: Q9.1 23.18,46.68 R14.1 23.23,49.57 R13.1
N$48
  Top 1.016: J8.1 22.27,44.1 Q9.3
N$49
  Top 0.508: S1.1 101.12,11.62 R28.2 103.91,11.6 R25.2 C9.2
N$50
  Top 0.508: C10.2 R26.2 R30.2 111.44,11.57 S2.1
N$51
  Bottom 0.305: J5.1 12.2,50 2.67,40.47 2.67,18.03 3.18,17.52
  Bottom 0.813: 3.18,17.52 J1.4
N$52
  Top 0.508: S3.1 121.78,13.65 R15.2 R27.2 C11.2
N$59  (via drill 0.35)
  Top 1.016: R7.1 57.49,26.08 56.3,24.89 v56.3,19.55
  Bottom 1.016: J1.3 13.22,17.52 13.72,18.02 44.72,18.02 46.25,19.55 v56.3,19.55
OVC_ALARM  (via drill 0.35)
  Top 0.813: J1.7 v29.15,22.6
  Bottom 0.508: X1.GP10 65.82,20.73 62.4,24.15 30.7,24.15 v29.15,22.6
OVCALARM
  Top 0.508: X1.GP7 70.81,30.89 66,26.08 D1.A
PEDAL
  Top 0.508: X1.GP8 71.75,28.35 65.2,21.8 R3.2
PEDAL+
  Top 0.406: 47.15,15.4 28.55,34 21.4,34 14.15,41.25 6.8,41.25 4.45,38.9 4.45,36 5.15,35.3
  Top 0.508: R6.1 47.15,15.4
  Top 0.813: J1.18 5.15,35.3
PEDAL-
  Top 0.305: IC1.9 62.9,6.7
  Top 0.406: 61.2,13.99 61.25,14.04 61.35,14.14
  Top 0.508: 27.89,33.11 47.01,13.99 61.2,13.99 | Q5.2 61.85,16.19 61.35,15.69 61.35,14.14 | 61.25,14.04 62.2,13.09 62.2,7.4 62.9,6.7
  Top 0.813: 27.89,33.11 9.57,33.11 J1.15
R2A  (via drill 0.35)
  Top 0.305: R9.2 34.58,42.12 v34.6,42.1
  Bottom 0.305: v34.6,42.1 34.6,37.8 35.5,36.9 69.8,36.9 71.41,38.51 X1.GP5
R3A  (via drill 0.35)
  Top 0.305: R13.2 25.68,41.92 25.7,41.9 v25.7,41.8
  Bottom 0.305: X1.GP6 72.37,33.43 69.5,36.3 26.7,36.3 25.7,37.3 v25.7,41.8
R_3V3  (via drill 0.35)
  Top 0.305: R11.2 44.48,42.28 v44.4,42.2
  Bottom 0.305: X1.GP4 45.55,41.05 v44.4,42.2
RST
  Top 0.508: R22.2 115.08,49.95 DISPLAY.5
S1
  Top 0.508: R28.1 97.2,11.6 97.2,24.3 95.69,25.81 X1.GP22
S2
  Top 0.508: R30.1 111.5,8.4 108.6,5.5 X1.GP16
S3  (via drill 0.35)
  Top 0.508: v92.6,2.7 118.1,2.7 121.78,6.38 R15.1
  Bottom 0.508: X1.GP15 76.51,5.49 79.3,2.7 v92.6,2.7
SEL
  Top 0.508: R31.1 11.87,7.28 4.95,14.2 4.95,21.77
  Top 0.813: J1.8 5.78,22.6 4.95,21.77
SS  (via drill 0.35)
  Top 0.508: R29.1 v123.4,41.1
  Bottom 0.508: X1.GP21 92.65,20.79 95.85,20.79 116.16,41.1 v123.4,41.1
USB_D+
  Bottom 0.305: X1.GP0 71.11,53.75 70.31,54.55 19.49,54.55 4.45,39.51 4.45,28.25 5.02,27.68
  Bottom 0.813: 5.02,27.68 J1.12
USB_D-
  Bottom 0.305: X1.GP1 71.01,51.21 68.41,53.81 20.26,53.81 5.15,38.7 5.15,30.55 5.5,30.2 | 6.66,30.2 J1.14
  Bottom 0.813: 5.5,30.2 6.66,30.2
VBUS_SENSE  (via drill 0.35)
  Top 0.254: IC1.4 61.1,5.7
  Top 0.305: 61.1,5.7 61.4,6
  Top 0.508: 61.4,6 61.4,11.2 59.52,13.08 46.46,13.08 27.49,32.05 v16.8,32.05
  Bottom 0.508: v16.8,32.05 16.7,32.05 10.91,37.84
  Bottom 0.813: 10.91,37.84 J1.19
VIN_17  (via drill 0.35)
  Top 0.305: R2.2 59.52,48.62 v59.8,48.9
  Top 0.508: R2.2 61.08,47.61 Q2.1
  Bottom 0.305: v59.8,48.9 68.2,48.9 70.97,46.13 X1.GP2
VIN_20  (via drill 0.35)
  Top 0.305: v51.2,49.2 50.67,48.67 Q3.1
  Top 0.508: Q3.1 48.84,47.71 R16.2
  Bottom 0.305: X1.GP3 53.41,43.59 52,45 52,48.8 51.6,49.2 v51.2,49.2
VOSEN  (via drill 0.35)
  Top 0.508: X1.GP26_A0 90.99,30.89 90.2,30.1 90.2,3.3 88.2,1.3 12.65,1.3 6.8,7.15 v6.8,8.35
  Bottom 0.508: J1.2 6.8,14.86
  Bottom 0.813: 6.8,14.86 v6.8,8.35
VOUT
  Bottom 1.016: J1.1 21.03,14.98 J9.1 J7.1
VSUPPLY  (via drill 1.5 pad 2.5)
  Top 0.406: Q7.3 55.2,43.09 | Q4.1 Q4.3
  Top 0.508: 55.2,43.09 Q7.1 | Q7.2 55.29,43.23 R5.1 | Q4.2 65.91,43.31 R1.1
  other vias: 63.3,51.54
  pour Top (isolate 0.254): 54.7,49.8 58.3,53.4 68.4,53.4 69.85,51.95 69.85,42.6 54.7,42.6

### Text on the board
tPlace: GND | VSUPPLY | 2A | 3A | 3v3 | DCDC OUT | OVC | PEDAL | SEL | MUX | S1 | S2 | S3 | EN_DCDC